# Altium project WLS.PrjPCB
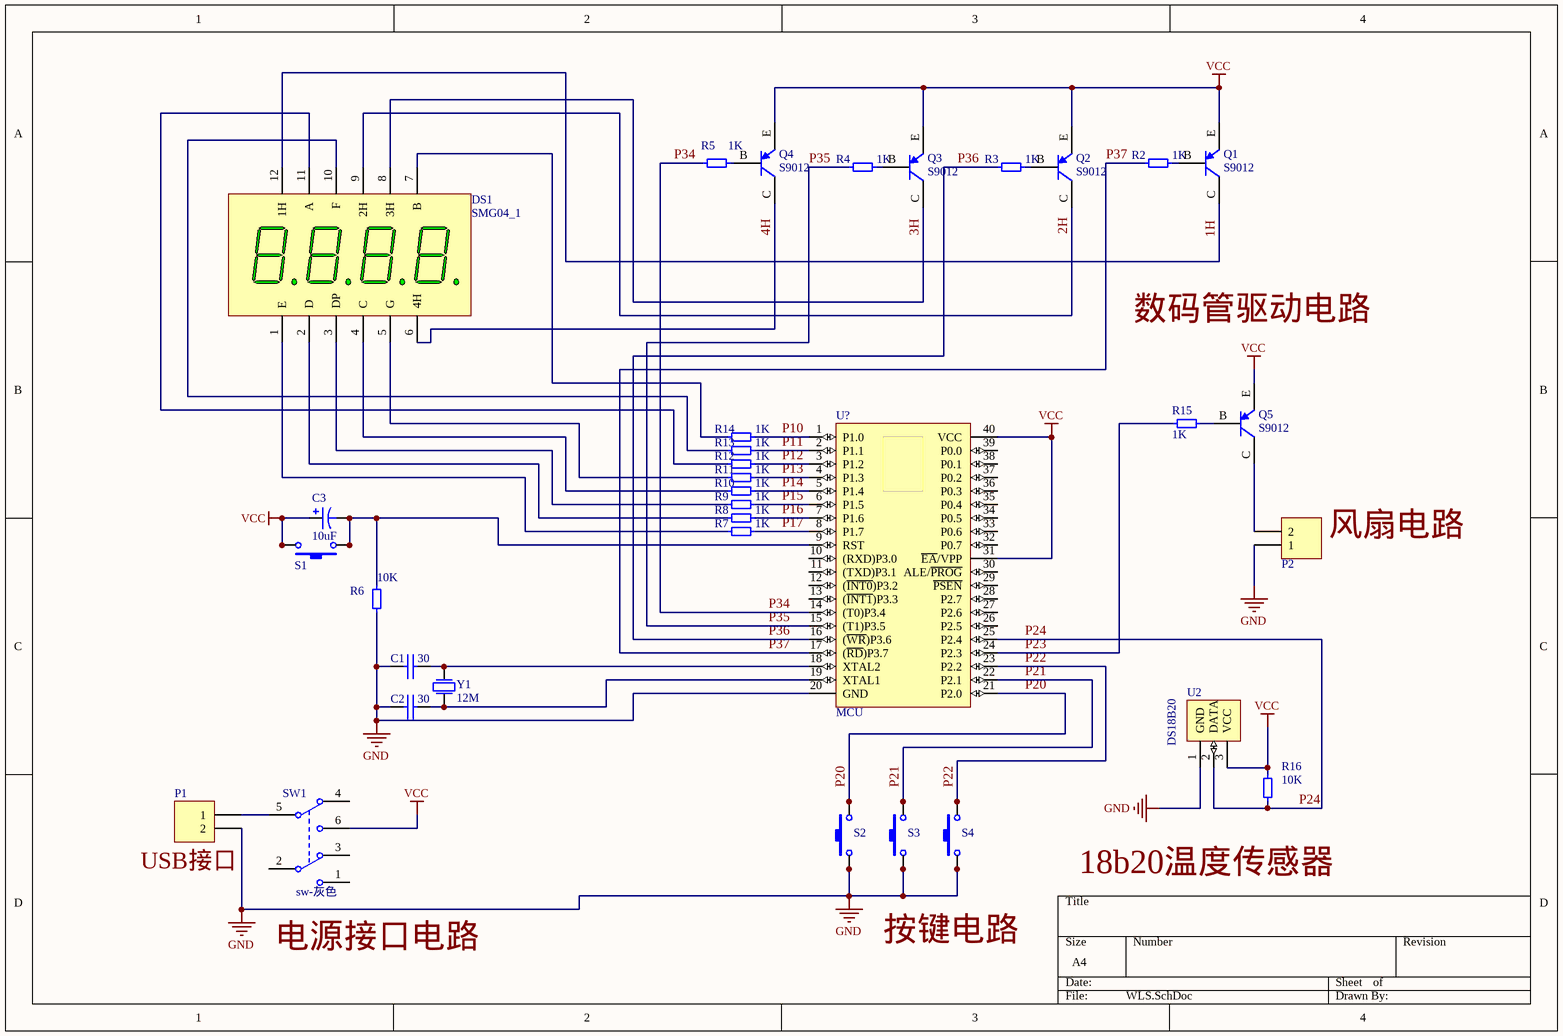
[diagram p0: WLS.SchDoc]
1 sheet, 35 parts. Net scope: global (net labels, ports and power ports of the same name join across sheets).
Board file: WLS.PcbDoc

## Sheet WLS.SchDoc
size A4

### Parts
C1  30  [CCP-4X5]
C2  30  [CCP-4X5]
C3  10uF  [CRB-2.54/5MM]
DS1  SMG04_1  [SMG04_1]
P1  Header 2  [DC002]  (value not drawn)
P2  Header 2  [HDR1X2]  (value not drawn)
Q1  S9012  [TO-92]
Q2  S9012  [TO-92]
Q3  S9012  [TO-92]
Q4  S9012  [TO-92]
Q5  S9012  [TO-92]
R2  1K  [RAXIAL-0.4_D]
R3  1K  [RAXIAL-0.4]
R4  1K  [RAXIAL-0.4]
R5  1K  [RAXIAL-0.4]
R6  10K  [RAXIAL-0.4]
R7  1K  [RAXIAL-0.4]
R8  1K  [RAXIAL-0.4]
R9  1K  [RAXIAL-0.4]
R10  1K  [RAXIAL-0.4]
R11  1K  [RAXIAL-0.4]
R12  1K  [RAXIAL-0.4]
R13  1K  [RAXIAL-0.4]
R14  1K  [RAXIAL-0.4]
R15  1K  [RAXIAL-0.4]
R16  10K  [RAXIAL-0.4]
S1  SW-PB  [SW6*6*5]  (value not drawn)
S2  SW-PB  [SW6*6*5]  (value not drawn)
S3  SW-PB  [SW6*6*5]  (value not drawn)
S4  SW-PB  [SW6*6*5]  (value not drawn)
SW1  sw-灰色  [SW8*8]
U2  DS18B20  [DS18B20]
U?  MCU  [DIP40]
W?  万用板  [W2_M7x9cm]  (value not drawn)
Y1  12M  [JZXTAL1]

### Nets
GND: C1.1 C2.1 P1.2 P2.1 R6.1 S2.1 S2.3 S3.1 S3.3 S4.1 S4.3 U2.1(GND) U?.20(GND)
VCC: C3.1 Q1.E Q2.E Q3.E Q4.E Q5.E R16.2 S1.2 S1.4 SW1.6(NO1) U2.3(VCC) U?.31(~{EA}/VPP) U?.40(VCC)
1H: DS1.12(1H) Q1.C
2H: DS1.9(2H) Q2.C
3H: DS1.8(3H) Q3.C
4H: DS1.6(4H) Q4.C
P10: R14.1 U?.1(P1.0)
P11: R13.1 U?.2(P1.1)
P12: R12.1 U?.3(P1.2)
P13: R11.1 U?.4(P1.3)
P14: R10.1 U?.5(P1.4)
P15: R9.1 U?.6(P1.5)
P16: R8.1 U?.7(P1.6)
P17: R7.1 U?.8(P1.7)
P20: S2.2 S2.4 U?.21(P2.0)
P21: S3.2 S3.4 U?.22(P2.1)
P22: S4.2 S4.4 U?.23(P2.2)
P23: R15.1 U?.24(P2.3)
P24: R16.1 U2.2(DATA) U?.25(P2.4)
P34: R5.2 U?.14((T0)P3.4)
P35: R4.2 U?.15((T1)P3.5)
P36: R3.2 U?.16((~{WR})P3.6)
P37: R2.2 U?.17((~{RD})P3.7)
NetC1_2: C1.2 U?.18(XTAL2) Y1.1(P1)
NetC2_2: C2.2 U?.19(XTAL1) Y1.2(P2)
NetC3_2: C3.2 R6.2 S1.1 S1.3 U?.9(RST)
NetDS1_1: DS1.1(E) R7.2
NetDS1_2: DS1.2(D) R8.2
NetDS1_3: DS1.3(DP) R9.2
NetDS1_4: DS1.4(C) R10.2
NetDS1_5: DS1.5(G) R11.2
NetDS1_7: DS1.7(B) R14.2
NetDS1_10: DS1.10(F) R13.2
NetDS1_11: DS1.11(A) R12.2
NetP1_1: P1.1 SW1.5(COMMON1)
NetP2_2: P2.2 Q5.C
NetQ1_B: Q1.B R2.1
NetQ2_B: Q2.B R3.1
NetQ3_B: Q3.B R4.1
NetQ4_B: Q4.B R5.1
NetQ5_B: Q5.B R15.2

Not connected (* = marked no-connect by the designer): SW1 1(NO2) 2(COMMON2) 3(NC2) 4(NC1); U? 10((RXD)P3.0) 11((TXD)P3.1) 12((~{INT0})P3.2) 13((~{INT1})P3.3) 26(P2.5) 27(P2.6) 28(P2.7) 29(~{PSEN}) 30(ALE/~{PROG}) 32(P0.7) 33(P0.6) 34(P0.5) 35(P0.4) 36(P0.3) 37(P0.2) 38(P0.1) 39(P0.0)

### Notes on the sheet
- Labels drawn without touching a wire or pin: 18b20温度传感器, USB接口, 按键电路, 数码管驱动电路, 电源接口电路, 风扇电路

### Library data of the parts
C1 C2 = CAP: 电容
C3 = Cap Pol1: Polarized Capacitor (Radial); Published: 8-Jun-2000; LatestRevisionDate: 17-Jul-2002; LatestRevisionNote: Re-released for DXP Platform.; PackageReference: RB7.6-15; Publisher: Altium Limited
P1 P2 = Header 2: Header, 2-Pin; LatestRevisionDate: 17-Jul-2002; LatestRevisionNote: Re-released for DXP Platform.; Publisher: Altium Limited
Q1-Q5 = S9012: PNP 三极管; Published: 8-Jun-2000; LatestRevisionDate: 29-May-2009; LatestRevisionNote: IPC-7351 Footprint Added.; PackageVersion: Aug-1999; PackageReference: SOT-23B; Publisher: Altium Limited; PackageDescription: 3-Pin SOT-23 Package 0.95 mm Pitch, 2.4 mm Lead Span
R2-R16 = RES2
S1-S4 = SW-PB: Switch; Published: 24-Mar-1999; LatestRevisionDate: 17-Jul-2002; LatestRevisionNote: Re-released for DXP Platform.; PackageReference: SPST-2; Publisher: Altium Limited
U? = U1
Y1 = 16M: Crystal Oscillator